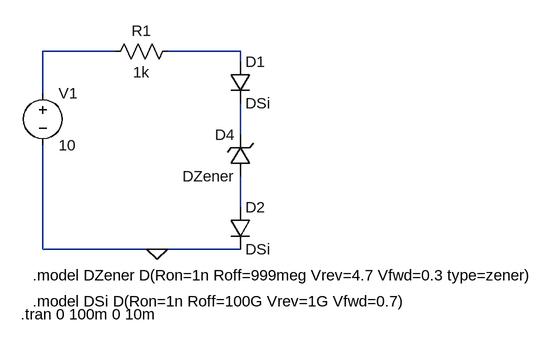
[diagram p0: schematic LucasSantosdeLuccaExercicio30.asc]
LucasSantosdeLuccaExercicio30.asc, the LTspice schematic file:
Version 4
SHEET 1 880 680
WIRE 112 48 0 48
WIRE 304 48 192 48
WIRE 304 64 304 48
WIRE 0 112 0 48
WIRE 304 176 304 128
WIRE 304 288 304 240
WIRE 0 352 0 192
WIRE 176 352 0 352
WIRE 304 352 176 352
FLAG 176 352 0
SYMBOL voltage 0 96 R0
SYMATTR InstName V1
SYMATTR Value 10
SYMBOL res 208 32 R90
WINDOW 0 0 56 VBottom 2
WINDOW 3 32 56 VTop 2
SYMATTR InstName R1
SYMATTR Value 1k
SYMBOL diode 288 64 R0
SYMATTR InstName D1
SYMATTR Value DSi
SYMBOL diode 288 288 R0
SYMATTR InstName D2
SYMATTR Value DSi
SYMBOL zener 320 240 R180
WINDOW 0 24 64 Left 2
WINDOW 3 24 0 Left 2
SYMATTR InstName D4
SYMATTR Value DZener
TEXT -16 392 Left 2 !.model DZener D(Ron=1n Roff=999meg Vrev=4.7 Vfwd=0.3 type=zener)
TEXT -16 432 Left 2 !.model DSi D(Ron=1n Roff=100G Vrev=1G Vfwd=0.7)
TEXT -34 452 Left 2 !.tran 0 100m 0 10m

The netlist it stands for:
* LucasSantosdeLuccaExercicio30.asc
V1 N001 0 10
R1 N002 N001 1k
D1 N002 N003 DSi
D2 N004 0 DSi
D4 N004 N003 DZener
.model D D
.lib standard.dio
.model DZener D(Ron=1n Roff=999meg Vrev=4.7 Vfwd=0.3 type=zener)
.model DSi D(Ron=1n Roff=100G Vrev=1G Vfwd=0.7)
.tran 0 100m 0 10m
.backanno
.end